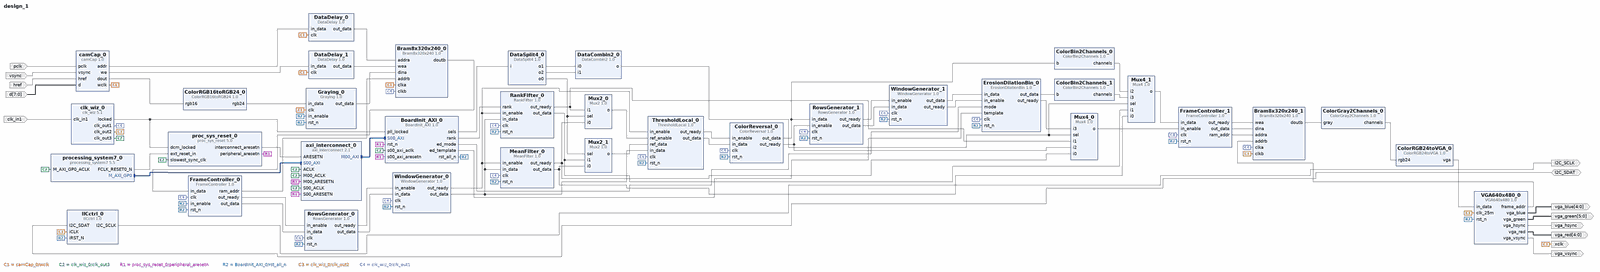
[diagram p0: block diagram of the top level, whole]
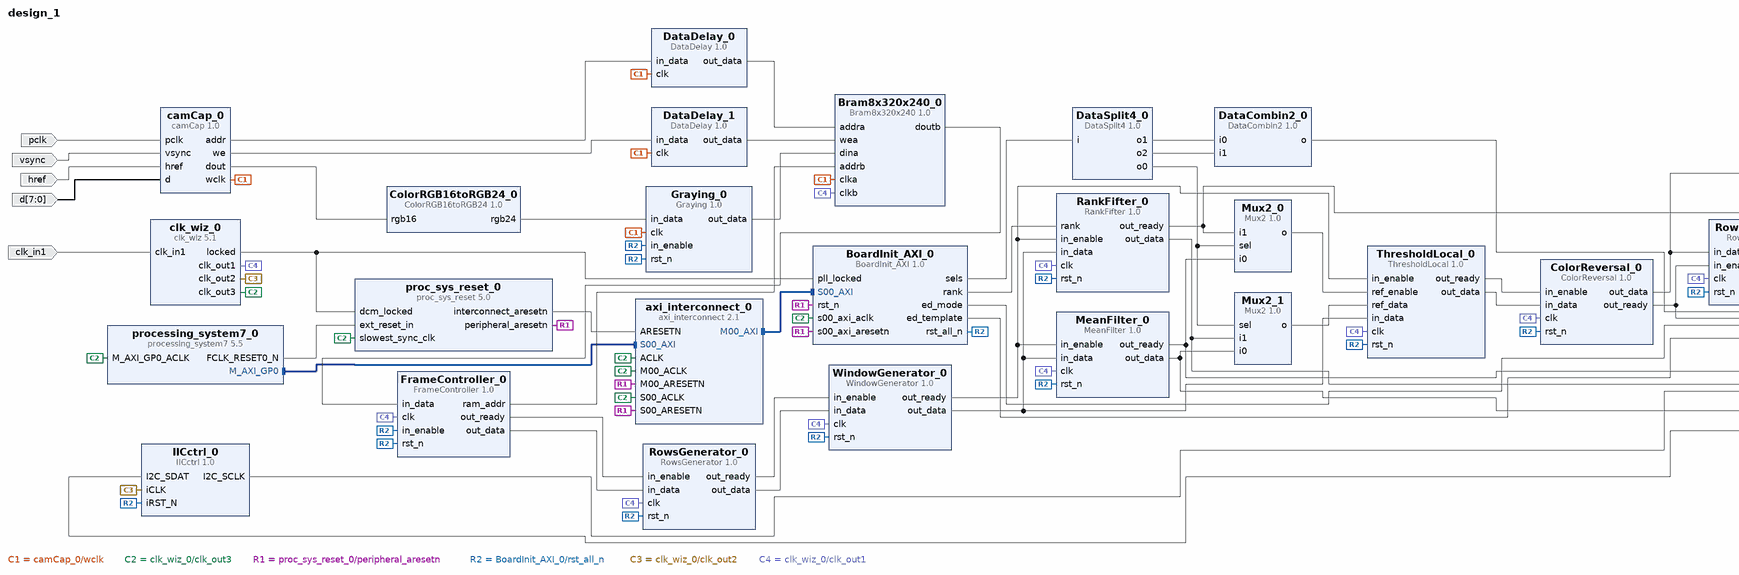
[diagram p1: block diagram of the top level, left part]
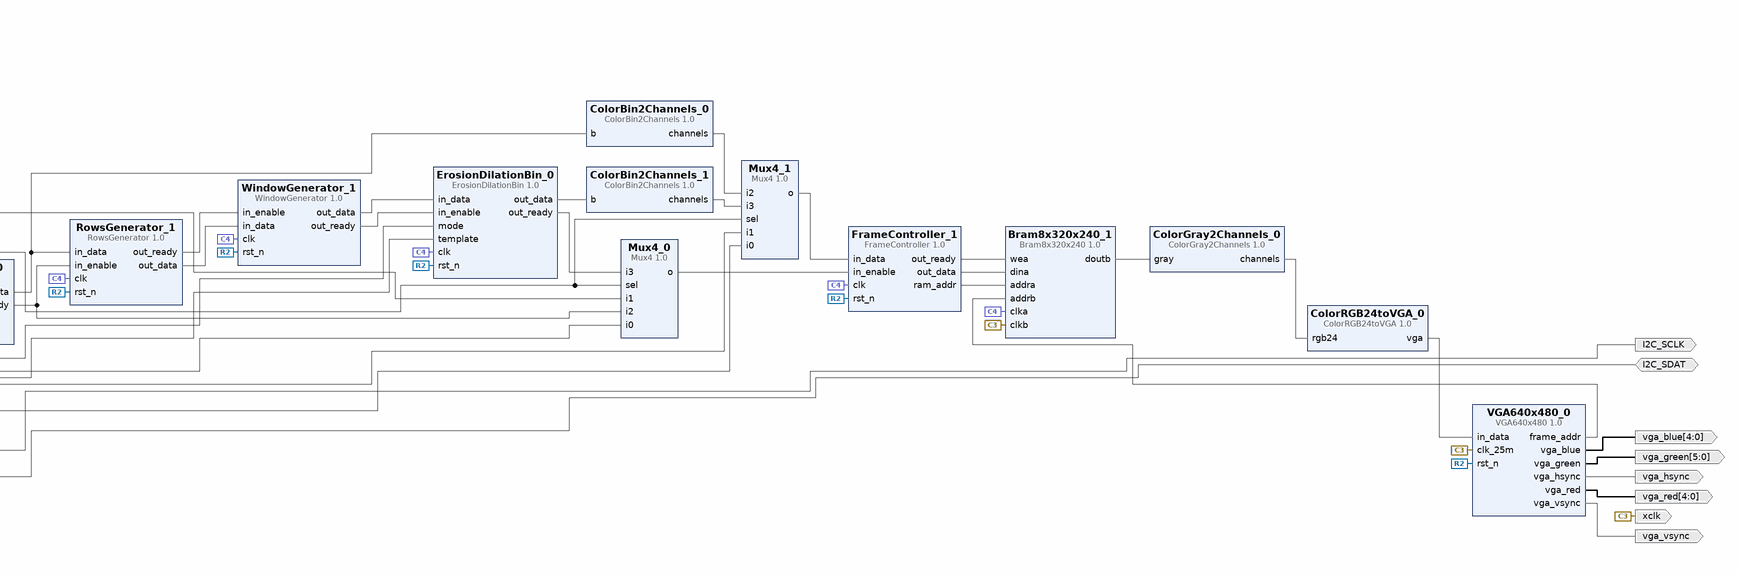
[diagram p2: block diagram of the top level, right part]
# Vivado block design design_1, Vivado 2014.4
create_bd_design design_1

create_bd_port -dir O xclk
create_bd_port -dir O -from 4 -to 0 vga_red
create_bd_port -dir O -from 5 -to 0 vga_green
create_bd_port -dir O -from 4 -to 0 vga_blue
create_bd_port -dir O vga_hsync
create_bd_port -dir O vga_vsync
create_bd_port -dir O I2C_SCLK
create_bd_port -dir IO I2C_SDAT
create_bd_port -dir I -type clk clk_in1
create_bd_port -dir I pclk
create_bd_port -dir I vsync
create_bd_port -dir I href
create_bd_port -dir I -from 7 -to 0 d

create_bd_cell -type ip -vlnv xilinx.com:ip:IICctrl:1.0 IICctrl_0
create_bd_cell -type ip -vlnv xilinx.com:ip:clk_wiz:5.1 clk_wiz_0
set_property -dict [list \
  CONFIG.CLKOUT2_USED true \
  CONFIG.CLKOUT3_USED true \
  CONFIG.CLKOUT4_USED true \
  CONFIG.NUM_OUT_CLKS 4 \
  CONFIG.CLKOUT1_REQUESTED_OUT_FREQ 25 \
  CONFIG.CLKOUT2_REQUESTED_OUT_FREQ 25 \
  CONFIG.CLKOUT3_REQUESTED_OUT_FREQ 50 \
  CONFIG.USE_RESET false \
  CONFIG.CLKOUT1_JITTER 175.402 \
  CONFIG.CLKOUT2_JITTER 175.402 \
  CONFIG.CLKOUT2_PHASE_ERROR 98.575 \
  CONFIG.CLKOUT3_JITTER 151.636 \
  CONFIG.CLKOUT3_PHASE_ERROR 98.575 \
  CONFIG.CLKOUT4_JITTER 130.958 \
  CONFIG.CLKOUT4_PHASE_ERROR 98.575 \
] [get_bd_cells clk_wiz_0]
create_bd_cell -type ip -vlnv xilinx.com:ip:processing_system7:5.5 processing_system7_0
set_property -dict [list \
  CONFIG.PCW_CRYSTAL_PERIPHERAL_FREQMHZ 50 \
  CONFIG.PCW_EN_CLK0_PORT 0 \
  CONFIG.PCW_UIPARAM_DDR_ENABLE 0 \
] [get_bd_cells processing_system7_0]
create_bd_cell -type ip -vlnv xilinx.com:ip:proc_sys_reset:5.0 proc_sys_reset_0
create_bd_cell -type ip -vlnv xilinx.com:ip:axi_interconnect:2.1 axi_interconnect_0
set_property -dict {CONFIG.NUM_MI 1} [get_bd_cells axi_interconnect_0]
create_bd_cell -type ip -vlnv xilinx.com:ip:Bram8x320x240:1.0 Bram8x320x240_0
create_bd_cell -type ip -vlnv dtysky.moe:F-I-L:FrameController:1.0 FrameController_0
set_property -dict {CONFIG.wr_mode 1} [get_bd_cells FrameController_0]
create_bd_cell -type ip -vlnv dtysky.moe:F-I-L:Graying:1.0 Graying_0
create_bd_cell -type ip -vlnv dtysky.moe:F-I-L:VGA640x480:1.0 VGA640x480_0
create_bd_cell -type ip -vlnv dtysky:Image:DataDelay:1.0 DataDelay_0
set_property -dict {CONFIG.data_width 17 CONFIG.delay 5} [get_bd_cells DataDelay_0]
create_bd_cell -type ip -vlnv dtysky.moe:F-I-L:FrameController:1.0 FrameController_1
set_property -dict {CONFIG.wr_mode 0 CONFIG.row_init 1} [get_bd_cells FrameController_1]
create_bd_cell -type ip -vlnv xilinx.com:ip:Bram8x320x240:1.0 Bram8x320x240_1
create_bd_cell -type ip -vlnv dtysky:Image:Mux4:1.0 Mux4_0
set_property -dict {CONFIG.data_width 1} [get_bd_cells Mux4_0]
create_bd_cell -type ip -vlnv dtysky:Image:Mux4:1.0 Mux4_1
create_bd_cell -type ip -vlnv xilinx.com:XUP:camCap:1.0 camCap_0
create_bd_cell -type ip -vlnv dtysky:Image:DataDelay:1.0 DataDelay_1
set_property -dict {CONFIG.data_width 1 CONFIG.delay 5} [get_bd_cells DataDelay_1]
create_bd_cell -type ip -vlnv dtysky.moe:F-I-L:ColorRGB16toRGB24:1.0 ColorRGB16toRGB24_0
create_bd_cell -type ip -vlnv dtysky.moe:F-I-L:ColorGray2Channels:1.0 ColorGray2Channels_0
create_bd_cell -type ip -vlnv dtysky.moe:F-I-L:BoardInit_AXI:1.0 BoardInit_AXI_0
set_property -dict {CONFIG.window_width 3} [get_bd_cells BoardInit_AXI_0]
create_bd_cell -type ip -vlnv dtysky.moe:F-I-L:ColorRGB24toVGA:1.0 ColorRGB24toVGA_0
create_bd_cell -type ip -vlnv dtysky.moe:F-I-L:ErosionDilationBin:1.0 ErosionDilationBin_0
create_bd_cell -type ip -vlnv dtysky.moe:F-I-L:MeanFilter:1.0 MeanFilter_0
create_bd_cell -type ip -vlnv dtysky.moe:F-I-L:RowsGenerator:1.0 RowsGenerator_0
create_bd_cell -type ip -vlnv dtysky.moe:F-I-L:WindowGenerator:1.0 WindowGenerator_0
set_property -dict {CONFIG.window_width 3} [get_bd_cells WindowGenerator_0]
create_bd_cell -type ip -vlnv dtysky:User:DataSplit4:1.0 DataSplit4_0
set_property -dict {CONFIG.data_width 1} [get_bd_cells DataSplit4_0]
create_bd_cell -type ip -vlnv dtysky.moe:F-I-L:RowsGenerator:1.0 RowsGenerator_1
set_property -dict {CONFIG.color_width 1} [get_bd_cells RowsGenerator_1]
create_bd_cell -type ip -vlnv dtysky.moe:F-I-L:WindowGenerator:1.0 WindowGenerator_1
set_property -dict {CONFIG.window_width 3 CONFIG.color_width 1} [get_bd_cells WindowGenerator_1]
create_bd_cell -type ip -vlnv dtysky:user:Mux2:1.0 Mux2_0
set_property -dict {CONFIG.data_width 1} [get_bd_cells Mux2_0]
create_bd_cell -type ip -vlnv dtysky:user:Mux2:1.0 Mux2_1
create_bd_cell -type ip -vlnv dtysky.moe:F-I-L:ThresholdLocal:1.0 ThresholdLocal_0
set_property -dict {CONFIG.in_window_width 3} [get_bd_cells ThresholdLocal_0]
create_bd_cell -type ip -vlnv dtysky.moe:F-I-L:ColorBin2Channels:1.0 ColorBin2Channels_0
set_property -dict {CONFIG.color_channels 1} [get_bd_cells ColorBin2Channels_0]
create_bd_cell -type ip -vlnv dtysky.moe:F-I-L:ColorBin2Channels:1.0 ColorBin2Channels_1
set_property -dict {CONFIG.color_channels 1} [get_bd_cells ColorBin2Channels_1]
create_bd_cell -type ip -vlnv dtysky:User:DataCombin2:1.0 DataCombin2_0
create_bd_cell -type ip -vlnv dtysky.moe:F-I-L:RankFifter:1.0 RankFifter_0
set_property -dict {CONFIG.window_width 3} [get_bd_cells RankFifter_0]
create_bd_cell -type ip -vlnv dtysky.moe:F-I-L:ColorReversal:1.0 ColorReversal_0
set_property -dict {CONFIG.color_channels 1 CONFIG.color_width 1} [get_bd_cells ColorReversal_0]

# ---- connections ----

connect_bd_intf_net [get_bd_intf_pins processing_system7_0/M_AXI_GP0] [get_bd_intf_pins axi_interconnect_0/S00_AXI]
connect_bd_intf_net [get_bd_intf_pins axi_interconnect_0/M00_AXI] [get_bd_intf_pins BoardInit_AXI_0/S00_AXI]
connect_bd_net [get_bd_pins camCap_0/wclk] \
  [get_bd_pins Graying_0/clk] [get_bd_pins DataDelay_0/clk] [get_bd_pins DataDelay_1/clk] [get_bd_pins Bram8x320x240_0/clka]
connect_bd_net [get_bd_pins camCap_0/we] [get_bd_pins DataDelay_1/in_data]
connect_bd_net [get_bd_pins DataDelay_1/out_data] [get_bd_pins Bram8x320x240_0/wea]
connect_bd_net [get_bd_pins DataDelay_0/out_data] [get_bd_pins Bram8x320x240_0/addra]
connect_bd_net [get_bd_pins camCap_0/addr] [get_bd_pins DataDelay_0/in_data]
connect_bd_net [get_bd_pins Graying_0/out_data] [get_bd_pins Bram8x320x240_0/dina]
connect_bd_net [get_bd_pins clk_wiz_0/clk_out3] \
  [get_bd_pins processing_system7_0/M_AXI_GP0_ACLK] [get_bd_pins proc_sys_reset_0/slowest_sync_clk] \
  [get_bd_pins BoardInit_AXI_0/s00_axi_aclk] [get_bd_pins axi_interconnect_0/ACLK] [get_bd_pins axi_interconnect_0/M00_ACLK] \
  [get_bd_pins axi_interconnect_0/S00_ACLK]
connect_bd_net [get_bd_pins clk_wiz_0/locked] [get_bd_pins proc_sys_reset_0/dcm_locked] [get_bd_pins BoardInit_AXI_0/pll_locked]
connect_bd_net [get_bd_pins processing_system7_0/FCLK_RESET0_N] [get_bd_pins proc_sys_reset_0/ext_reset_in]
connect_bd_net [get_bd_pins proc_sys_reset_0/interconnect_aresetn] [get_bd_pins axi_interconnect_0/ARESETN]
connect_bd_net [get_bd_pins proc_sys_reset_0/peripheral_aresetn] \
  [get_bd_pins BoardInit_AXI_0/rst_n] [get_bd_pins BoardInit_AXI_0/s00_axi_aresetn] \
  [get_bd_pins axi_interconnect_0/S00_ARESETN] [get_bd_pins axi_interconnect_0/M00_ARESETN]
connect_bd_net [get_bd_pins camCap_0/dout] [get_bd_pins ColorRGB16toRGB24_0/rgb16]
connect_bd_net [get_bd_pins ColorRGB16toRGB24_0/rgb24] [get_bd_pins Graying_0/in_data]
connect_bd_net [get_bd_pins Bram8x320x240_0/doutb] [get_bd_pins FrameController_0/in_data]
connect_bd_net [get_bd_pins FrameController_0/ram_addr] [get_bd_pins Bram8x320x240_0/addrb]
connect_bd_net [get_bd_pins Mux4_0/o] [get_bd_pins FrameController_1/in_enable]
connect_bd_net [get_bd_pins Mux4_1/o] [get_bd_pins FrameController_1/in_data]
connect_bd_net [get_bd_pins FrameController_1/out_ready] [get_bd_pins Bram8x320x240_1/wea]
connect_bd_net [get_bd_pins FrameController_1/out_data] [get_bd_pins Bram8x320x240_1/dina]
connect_bd_net [get_bd_pins FrameController_1/ram_addr] [get_bd_pins Bram8x320x240_1/addra]
connect_bd_net [get_bd_pins VGA640x480_0/frame_addr] [get_bd_pins Bram8x320x240_1/addrb]
connect_bd_net [get_bd_pins Bram8x320x240_1/doutb] [get_bd_pins ColorGray2Channels_0/gray]
connect_bd_net [get_bd_pins BoardInit_AXI_0/rst_all_n] \
  [get_bd_pins FrameController_0/rst_n] [get_bd_pins FrameController_1/rst_n] [get_bd_pins Graying_0/rst_n] \
  [get_bd_pins IICctrl_0/iRST_N] [get_bd_pins VGA640x480_0/rst_n] [get_bd_pins FrameController_0/in_enable] \
  [get_bd_pins Graying_0/in_enable] [get_bd_pins ErosionDilationBin_0/rst_n] [get_bd_pins MeanFilter_0/rst_n] \
  [get_bd_pins RowsGenerator_0/rst_n] [get_bd_pins RowsGenerator_1/rst_n] [get_bd_pins ThresholdLocal_0/rst_n] \
  [get_bd_pins WindowGenerator_0/rst_n] [get_bd_pins WindowGenerator_1/rst_n] [get_bd_pins RankFifter_0/rst_n] \
  [get_bd_pins ColorReversal_0/rst_n]
connect_bd_net [get_bd_pins clk_wiz_0/clk_out2] \
  [get_bd_ports xclk] [get_bd_pins IICctrl_0/iCLK] [get_bd_pins VGA640x480_0/clk_25m] [get_bd_pins Bram8x320x240_1/clkb]
connect_bd_net [get_bd_pins clk_wiz_0/clk_out1] \
  [get_bd_pins Bram8x320x240_0/clkb] [get_bd_pins Bram8x320x240_1/clka] [get_bd_pins FrameController_0/clk] \
  [get_bd_pins FrameController_1/clk] [get_bd_pins ErosionDilationBin_0/clk] [get_bd_pins MeanFilter_0/clk] \
  [get_bd_pins RowsGenerator_0/clk] [get_bd_pins RowsGenerator_1/clk] [get_bd_pins ThresholdLocal_0/clk] \
  [get_bd_pins WindowGenerator_0/clk] [get_bd_pins WindowGenerator_1/clk] [get_bd_pins RankFifter_0/clk] \
  [get_bd_pins ColorReversal_0/clk]
connect_bd_net [get_bd_pins VGA640x480_0/vga_red] [get_bd_ports vga_red]
connect_bd_net [get_bd_pins VGA640x480_0/vga_green] [get_bd_ports vga_green]
connect_bd_net [get_bd_pins VGA640x480_0/vga_blue] [get_bd_ports vga_blue]
connect_bd_net [get_bd_pins VGA640x480_0/vga_hsync] [get_bd_ports vga_hsync]
connect_bd_net [get_bd_pins VGA640x480_0/vga_vsync] [get_bd_ports vga_vsync]
connect_bd_net [get_bd_pins IICctrl_0/I2C_SCLK] [get_bd_ports I2C_SCLK]
connect_bd_net [get_bd_ports I2C_SDAT] [get_bd_pins IICctrl_0/I2C_SDAT]
connect_bd_net -net clk_in1_1 [get_bd_ports clk_in1] [get_bd_pins clk_wiz_0/clk_in1]
connect_bd_net [get_bd_ports pclk] [get_bd_pins camCap_0/pclk]
connect_bd_net [get_bd_ports vsync] [get_bd_pins camCap_0/vsync]
connect_bd_net [get_bd_ports href] [get_bd_pins camCap_0/href]
connect_bd_net [get_bd_ports d] [get_bd_pins camCap_0/d]
connect_bd_net [get_bd_pins ColorRGB24toVGA_0/vga] [get_bd_pins VGA640x480_0/in_data]
connect_bd_net [get_bd_pins ColorGray2Channels_0/channels] [get_bd_pins ColorRGB24toVGA_0/rgb24]
connect_bd_net [get_bd_pins FrameController_0/out_ready] [get_bd_pins RowsGenerator_0/in_enable]
connect_bd_net [get_bd_pins FrameController_0/out_data] [get_bd_pins RowsGenerator_0/in_data]
connect_bd_net [get_bd_pins RowsGenerator_0/out_ready] [get_bd_pins WindowGenerator_0/in_enable]
connect_bd_net [get_bd_pins RowsGenerator_0/out_data] [get_bd_pins WindowGenerator_0/in_data]
connect_bd_net [get_bd_pins WindowGenerator_0/out_ready] \
  [get_bd_pins MeanFilter_0/in_enable] [get_bd_pins ThresholdLocal_0/in_enable] [get_bd_pins RankFifter_0/in_enable]
connect_bd_net [get_bd_pins WindowGenerator_0/out_data] \
  [get_bd_pins MeanFilter_0/in_data] [get_bd_pins ThresholdLocal_0/in_data] [get_bd_pins RankFifter_0/in_data]
connect_bd_net [get_bd_pins MeanFilter_0/out_ready] [get_bd_pins Mux2_0/i0] [get_bd_pins Mux4_0/i0]
connect_bd_net [get_bd_pins RankFifter_0/out_ready] [get_bd_pins Mux2_0/i1] [get_bd_pins Mux4_0/i1]
connect_bd_net [get_bd_pins DataSplit4_0/o0] [get_bd_pins Mux2_0/sel] [get_bd_pins Mux2_1/sel]
connect_bd_net [get_bd_pins RankFifter_0/out_data] [get_bd_pins Mux2_1/i1] [get_bd_pins Mux4_1/i1]
connect_bd_net [get_bd_pins MeanFilter_0/out_data] [get_bd_pins Mux2_1/i0] [get_bd_pins Mux4_1/i0]
connect_bd_net [get_bd_pins BoardInit_AXI_0/sels] [get_bd_pins DataSplit4_0/i]
connect_bd_net [get_bd_pins Mux2_1/o] [get_bd_pins ThresholdLocal_0/ref_data]
connect_bd_net [get_bd_pins Mux2_0/o] [get_bd_pins ThresholdLocal_0/ref_enable]
connect_bd_net [get_bd_pins RowsGenerator_1/out_ready] [get_bd_pins WindowGenerator_1/in_enable]
connect_bd_net [get_bd_pins RowsGenerator_1/out_data] [get_bd_pins WindowGenerator_1/in_data]
connect_bd_net [get_bd_pins WindowGenerator_1/out_data] [get_bd_pins ErosionDilationBin_0/in_data]
connect_bd_net [get_bd_pins WindowGenerator_1/out_ready] [get_bd_pins ErosionDilationBin_0/in_enable]
connect_bd_net [get_bd_pins ErosionDilationBin_0/out_ready] [get_bd_pins Mux4_0/i3]
connect_bd_net [get_bd_pins DataSplit4_0/o1] [get_bd_pins DataCombin2_0/i0]
connect_bd_net [get_bd_pins DataSplit4_0/o2] [get_bd_pins DataCombin2_0/i1]
connect_bd_net [get_bd_pins DataCombin2_0/o] [get_bd_pins Mux4_0/sel] [get_bd_pins Mux4_1/sel]
connect_bd_net [get_bd_pins ErosionDilationBin_0/out_data] [get_bd_pins ColorBin2Channels_1/b]
connect_bd_net [get_bd_pins ColorBin2Channels_1/channels] [get_bd_pins Mux4_1/i3]
connect_bd_net [get_bd_pins ColorBin2Channels_0/channels] [get_bd_pins Mux4_1/i2]
connect_bd_net [get_bd_pins BoardInit_AXI_0/ed_mode] [get_bd_pins ErosionDilationBin_0/mode]
connect_bd_net [get_bd_pins BoardInit_AXI_0/ed_template] [get_bd_pins ErosionDilationBin_0/template]
connect_bd_net [get_bd_pins BoardInit_AXI_0/rank] [get_bd_pins RankFifter_0/rank]
connect_bd_net [get_bd_pins ThresholdLocal_0/out_ready] [get_bd_pins ColorReversal_0/in_enable]
connect_bd_net [get_bd_pins ThresholdLocal_0/out_data] [get_bd_pins ColorReversal_0/in_data]
connect_bd_net [get_bd_pins ColorReversal_0/out_ready] [get_bd_pins RowsGenerator_1/in_enable] [get_bd_pins Mux4_0/i2]
connect_bd_net [get_bd_pins ColorReversal_0/out_data] [get_bd_pins RowsGenerator_1/in_data] [get_bd_pins ColorBin2Channels_0/b]

# ---- address map ----
assign_bd_address -offset 0x43C00000 -range 64K -target_address_space [get_bd_addr_spaces processing_system7_0/Data] [get_bd_addr_segs BoardInit_AXI_0/S00_AXI/S00_AXI_reg]

validate_bd_design
save_bd_design
